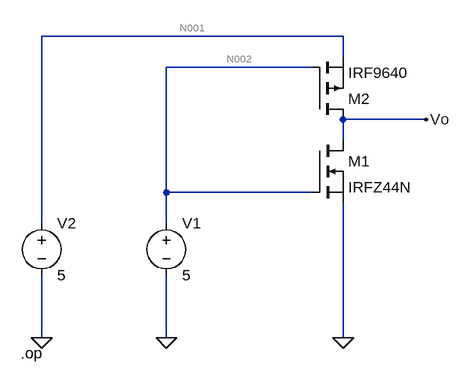
[diagram p0: schematic cmos.asc]
cmos.asc, the LTspice schematic file:
Version 4
SHEET 1 880 680
WIRE 448 -48 -16 -48
WIRE 448 -16 448 -48
WIRE 400 0 176 0
WIRE 448 80 448 64
WIRE 576 80 448 80
WIRE 448 112 448 80
WIRE 176 192 176 0
WIRE 400 192 176 192
WIRE -16 240 -16 -48
WIRE 176 240 176 192
WIRE -16 416 -16 320
WIRE 176 416 176 320
WIRE 448 416 448 208
FLAG 576 80 Vo
FLAG 448 416 0
FLAG 176 416 0
FLAG -16 416 0
SYMBOL nmos 400 112 R0
SYMATTR InstName M1
SYMATTR Value IRFZ44N
SYMBOL voltage 176 224 R0
WINDOW 123 0 0 Left 0
WINDOW 39 0 0 Left 0
SYMATTR InstName V1
SYMATTR Value 5
SYMBOL voltage -16 224 R0
WINDOW 123 0 0 Left 0
WINDOW 39 0 0 Left 0
SYMATTR InstName V2
SYMATTR Value 5
SYMBOL pmos 400 80 M180
SYMATTR InstName M2
SYMATTR Value IRF9640
TEXT -48 440 Left 2 !.op

The netlist it stands for:
* cmos.asc
M1 Vo N002 0 0 IRFZ44N
V1 N002 0 5
V2 N001 0 5
M2 Vo N002 N001 N001 IRF9640
.model NMOS NMOS
.model PMOS PMOS
.lib standard.mos
.op
.backanno
.end

* Results of the author's LTspice run, read from the files saved beside the schematic
* Operating Point:
*   V(vo) = 2.766 pV
*   V(n002) = 5 V
*   V(n001) = 5 V
*   Id(M2) = 136.8 pA
*   Ig(M2) = -179.8 pA
*   Is(M2) = 43 pA
*   Id(M1) = 2.048 nA
*   Ig(M1) = -2 nA
*   Is(M1) = -47.99 pA
*   I(V2) = -48 pA
*   I(V1) = 0 A
* From the log:
*   Semiconductor Device Operating Points:
*                           --- VDMOSFET Transistors ---
*   Name:          m2          m1
*   Model:       irf9640     irfz44n
*   Id:          1.37e-10    2.05e-09
*   Vgs:         0.00e+00    5.00e+00
*   Vds:        -5.00e+00    2.77e-12
*   Vth:        -3.50e+00    4.00e+00
*   Gm:          3.53e-31    4.80e-11
*   Gds:         1.77e-34    1.90e+01
*   Cgs:         1.00e-09    1.40e-09
*   Cgd:         1.80e-10    2.00e-09
*   Cbody:       4.08e-10    9.00e-10